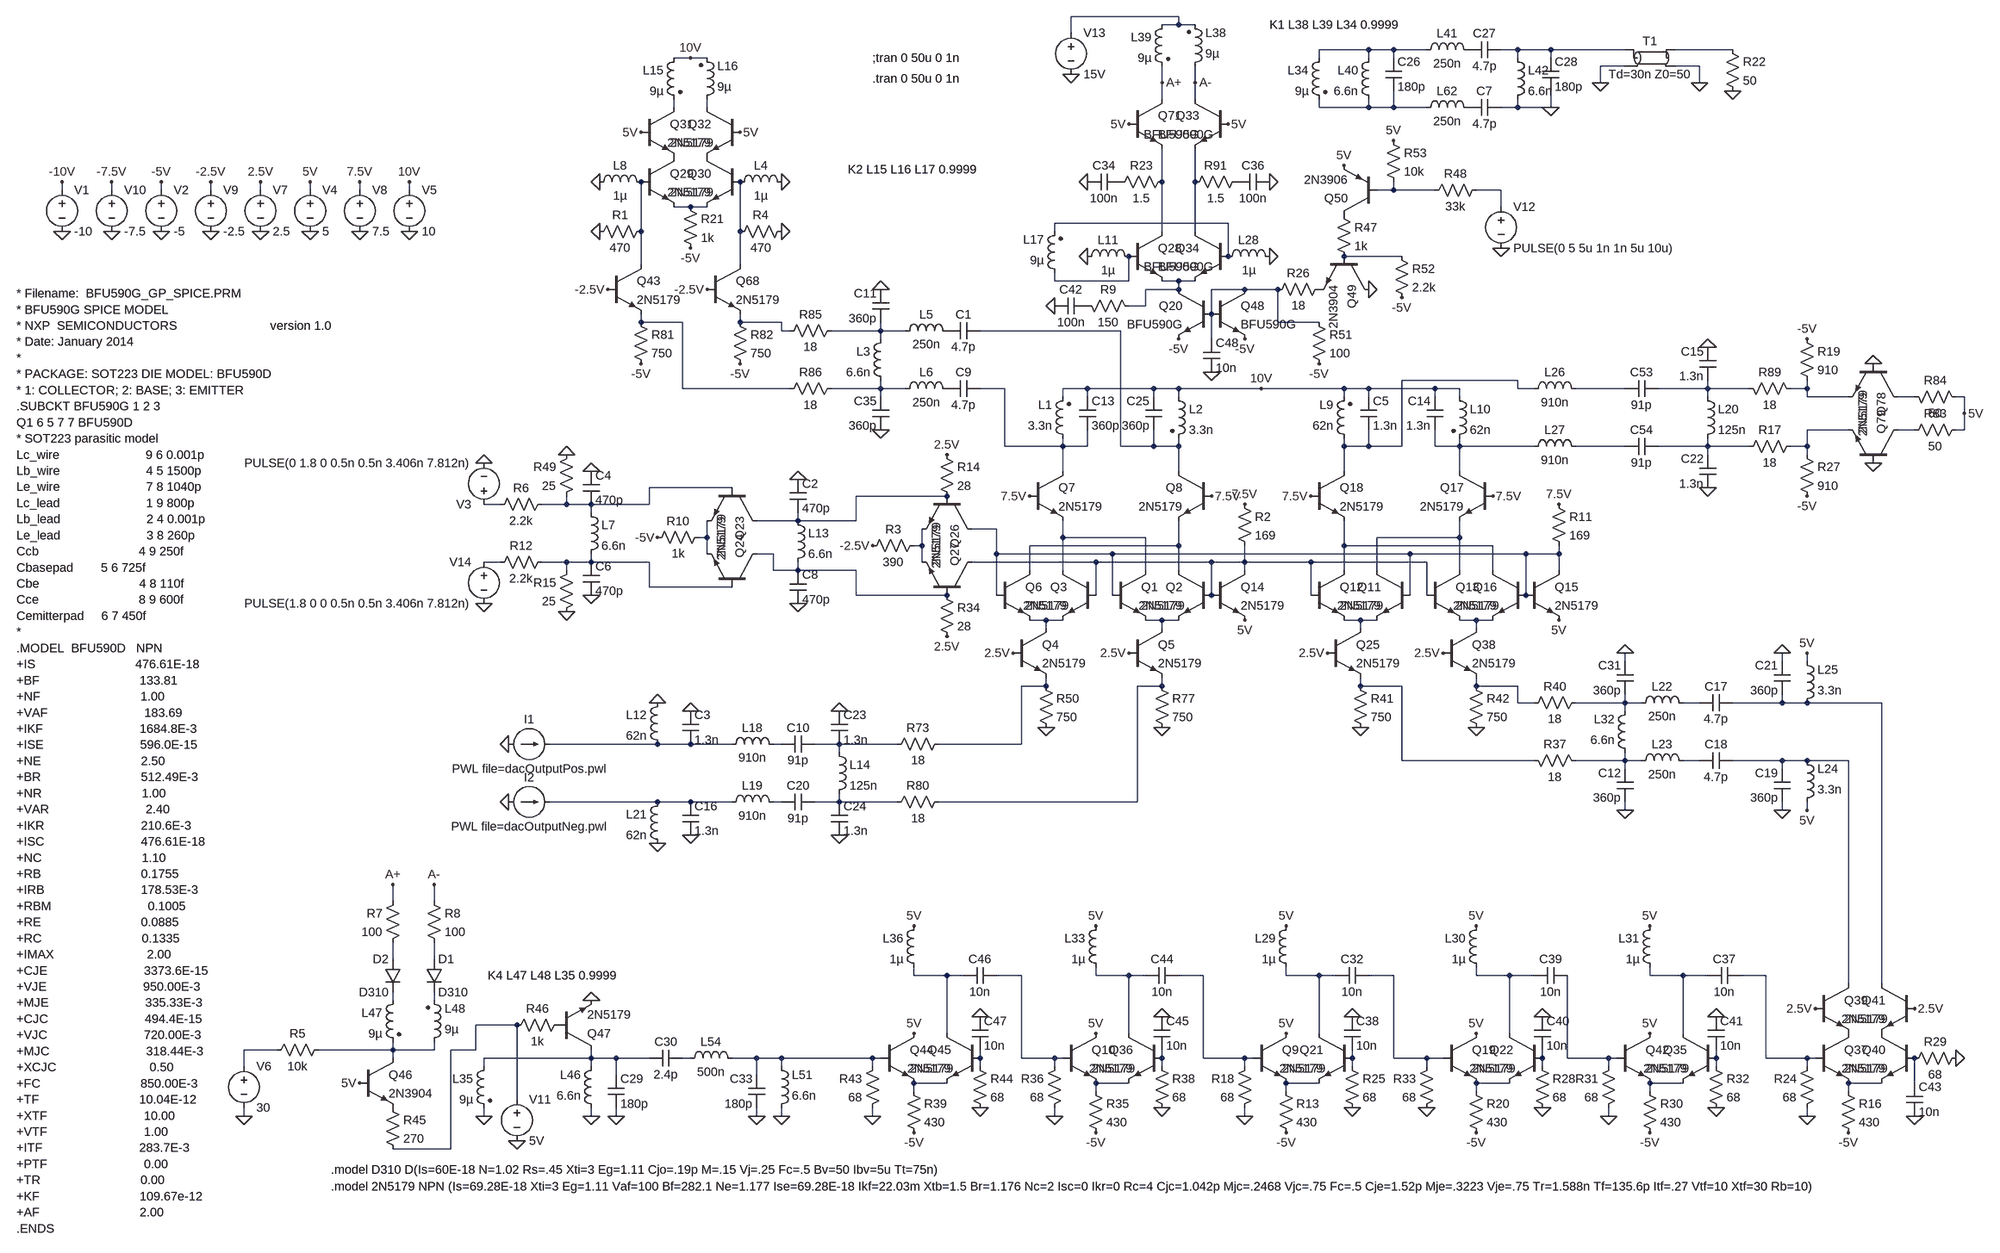
[diagram p0: schematic radio.asc]
radio.asc, the LTspice schematic file:
Version 4
SHEET 1 2964 2260
WIRE 352 -976 144 -976
WIRE 352 -960 352 -976
WIRE 352 -960 320 -960
WIRE 384 -960 352 -960
WIRE 144 -944 144 -976
WIRE 720 -912 624 -912
WIRE 768 -912 720 -912
WIRE 832 -912 768 -912
WIRE 1008 -912 976 -912
WIRE 1072 -912 1008 -912
WIRE 1216 -912 1072 -912
WIRE 1424 -912 1312 -912
WIRE -592 -896 -624 -896
WIRE -560 -896 -592 -896
WIRE 624 -896 624 -912
WIRE 720 -896 720 -912
WIRE 768 -896 768 -912
WIRE 1008 -896 1008 -912
WIRE 1072 -896 1072 -912
WIRE 1216 -880 1168 -880
WIRE 1360 -880 1312 -880
WIRE 320 -848 320 -880
WIRE 384 -848 384 -880
WIRE 1168 -848 1168 -880
WIRE 1360 -848 1360 -880
WIRE 320 -816 320 -848
WIRE 384 -816 384 -848
WIRE -624 -800 -624 -816
WIRE -560 -800 -560 -816
WIRE 624 -800 624 -816
WIRE 720 -800 720 -816
WIRE 720 -800 624 -800
WIRE 768 -800 768 -832
WIRE 768 -800 720 -800
WIRE 832 -800 768 -800
WIRE 1008 -800 1008 -816
WIRE 1008 -800 976 -800
WIRE 1072 -800 1072 -832
WIRE 1072 -800 1008 -800
WIRE 320 -656 320 -720
WIRE 384 -656 384 -720
WIRE -1808 -640 -1808 -656
WIRE -1712 -640 -1712 -656
WIRE -1616 -640 -1616 -656
WIRE -1520 -640 -1520 -656
WIRE -1424 -640 -1424 -656
WIRE -1328 -640 -1328 -656
WIRE -1232 -640 -1232 -656
WIRE -1136 -640 -1136 -656
WIRE 768 -640 768 -656
WIRE 768 -640 736 -640
WIRE 848 -640 768 -640
WIRE 976 -640 928 -640
WIRE -592 -608 -624 -608
WIRE -560 -608 -592 -608
WIRE 976 -608 976 -640
WIRE 448 -576 112 -576
WIRE -688 -560 -688 -656
WIRE -496 -560 -496 -656
WIRE 112 -560 112 -576
WIRE 320 -560 320 -656
WIRE 384 -560 384 -656
WIRE 448 -512 448 -576
WIRE 784 -512 672 -512
WIRE -688 -496 -688 -560
WIRE -496 -496 -496 -560
WIRE 112 -464 112 -480
WIRE 256 -464 256 -512
WIRE 256 -464 112 -464
WIRE 352 -464 320 -464
WIRE 384 -464 352 -464
WIRE 352 -448 352 -464
WIRE 352 -448 288 -448
WIRE 480 -448 416 -448
WIRE 544 -448 480 -448
WIRE 288 -416 288 -448
WIRE 288 -416 256 -416
WIRE 416 -400 416 -448
WIRE -688 -384 -688 -400
WIRE -608 -384 -688 -384
WIRE -496 -384 -496 -400
WIRE -416 -384 -496 -384
WIRE 544 -384 544 -448
WIRE 624 -384 544 -384
WIRE -416 -368 -416 -384
WIRE -400 -368 -416 -368
WIRE -224 -368 -224 -384
WIRE -224 -368 -320 -368
WIRE -176 -368 -224 -368
WIRE 240 -368 -32 -368
WIRE -224 -352 -224 -368
WIRE 416 -352 416 -400
WIRE 1008 -272 784 -272
WIRE -608 -256 -608 -384
WIRE -400 -256 -608 -256
WIRE -224 -256 -224 -272
WIRE -224 -256 -320 -256
WIRE -176 -256 -224 -256
WIRE 16 -256 -32 -256
WIRE 176 -256 128 -256
WIRE 304 -256 176 -256
WIRE 352 -256 304 -256
WIRE 512 -256 352 -256
WIRE 672 -256 512 -256
WIRE 720 -256 672 -256
WIRE 848 -256 720 -256
WIRE 896 -256 848 -256
WIRE 1008 -256 1008 -272
WIRE 1040 -256 1008 -256
WIRE 1216 -256 1120 -256
WIRE 1376 -256 1376 -272
WIRE 1376 -256 1280 -256
WIRE 1456 -256 1376 -256
WIRE 1568 -256 1568 -272
WIRE 1568 -256 1536 -256
WIRE -224 -240 -224 -256
WIRE 128 -240 128 -256
WIRE 176 -240 176 -256
WIRE 304 -240 304 -256
WIRE 352 -240 352 -256
WIRE 672 -240 672 -256
WIRE 720 -240 720 -256
WIRE 848 -240 848 -256
WIRE 896 -240 896 -256
WIRE 1376 -240 1376 -256
WIRE 1568 -240 1568 -256
WIRE 1648 -240 1568 -240
WIRE 1776 -240 1744 -240
WIRE 1872 -240 1856 -240
WIRE 1872 -208 1872 -240
WIRE 1648 -176 1568 -176
WIRE 1776 -176 1744 -176
WIRE 1872 -176 1872 -208
WIRE 1872 -176 1856 -176
WIRE 16 -144 16 -256
WIRE 128 -144 128 -160
WIRE 128 -144 16 -144
WIRE 176 -144 176 -176
WIRE 176 -144 128 -144
WIRE 240 -144 240 -368
WIRE 304 -144 304 -176
WIRE 304 -144 240 -144
WIRE 352 -144 352 -160
WIRE 352 -144 304 -144
WIRE 672 -144 672 -160
WIRE 720 -144 720 -176
WIRE 720 -144 672 -144
WIRE 784 -144 784 -272
WIRE 784 -144 720 -144
WIRE 848 -144 848 -176
WIRE 896 -144 896 -160
WIRE 896 -144 848 -144
WIRE 1040 -144 896 -144
WIRE 1216 -144 1120 -144
WIRE 1376 -144 1376 -160
WIRE 1376 -144 1280 -144
WIRE 1456 -144 1376 -144
WIRE 1568 -144 1568 -176
WIRE 1568 -144 1536 -144
WIRE 1376 -128 1376 -144
WIRE 1568 -128 1568 -144
WIRE 128 -96 128 -144
WIRE 352 -96 352 -144
WIRE 672 -96 672 -144
WIRE 896 -96 896 -144
WIRE -512 -64 -672 -64
WIRE -96 -48 -272 -48
WIRE -960 -32 -992 -32
WIRE -832 -32 -832 -48
WIRE -832 -32 -880 -32
WIRE -784 -32 -832 -32
WIRE -672 -32 -672 -64
WIRE -672 -32 -784 -32
WIRE -784 -16 -784 -32
WIRE -384 0 -384 -16
WIRE -384 0 -464 0
WIRE -272 0 -272 -48
WIRE -272 0 -384 0
WIRE 0 16 -48 16
WIRE -560 32 -560 0
WIRE -560 32 -576 32
WIRE 128 32 128 0
WIRE 288 32 128 32
WIRE 896 32 896 0
WIRE 896 32 736 32
WIRE -144 48 -144 16
WIRE -144 48 -160 48
WIRE 352 48 352 0
WIRE 352 48 64 48
WIRE 672 48 672 0
WIRE 960 48 672 48
WIRE -560 64 -560 32
WIRE -432 64 -464 64
WIRE 0 64 0 16
WIRE 224 64 0 64
WIRE 800 64 224 64
WIRE 1024 64 800 64
WIRE 1088 64 1088 48
WIRE 1088 64 1024 64
WIRE -960 80 -992 80
WIRE -832 80 -880 80
WIRE -784 80 -784 64
WIRE -784 80 -832 80
WIRE -672 80 -784 80
WIRE -144 80 -144 48
WIRE 192 80 -48 80
WIRE 416 80 192 80
WIRE 480 80 480 48
WIRE 480 80 416 80
WIRE 608 80 480 80
WIRE 832 80 608 80
WIRE -832 96 -832 80
WIRE -432 96 -432 64
WIRE -384 96 -384 80
WIRE -384 96 -432 96
WIRE -272 96 -384 96
WIRE 64 96 64 48
WIRE 128 96 128 32
WIRE 288 96 288 32
WIRE 352 96 352 48
WIRE 480 96 480 80
WIRE 672 96 672 48
WIRE 736 96 736 32
WIRE 896 96 896 32
WIRE 960 96 960 48
WIRE 1088 96 1088 64
WIRE -672 128 -672 80
WIRE -512 128 -672 128
WIRE -272 144 -272 96
WIRE -96 144 -272 144
WIRE 0 144 0 64
WIRE 192 144 192 80
WIRE 224 144 224 64
WIRE 416 144 416 80
WIRE 608 144 608 80
WIRE 800 144 800 64
WIRE 832 144 832 80
WIRE 1024 144 1024 64
WIRE 96 192 64 192
WIRE 128 192 96 192
WIRE 320 192 288 192
WIRE 352 192 320 192
WIRE 704 192 672 192
WIRE 736 192 704 192
WIRE 928 192 896 192
WIRE 960 192 928 192
WIRE 96 208 96 192
WIRE 320 208 320 192
WIRE 704 208 704 192
WIRE 928 208 928 192
WIRE 1216 272 1216 256
WIRE 1520 272 1520 256
WIRE 1568 272 1568 256
WIRE 96 320 96 304
WIRE 96 320 48 320
WIRE 320 320 320 304
WIRE 320 320 272 320
WIRE 704 320 704 304
WIRE 784 320 704 320
WIRE 928 320 928 304
WIRE 1008 320 928 320
WIRE 1008 352 1008 320
WIRE 1040 352 1008 352
WIRE 1216 352 1216 336
WIRE 1216 352 1120 352
WIRE 1248 352 1216 352
WIRE 1360 352 1328 352
WIRE 1520 352 1520 336
WIRE 1520 352 1424 352
WIRE 1568 352 1520 352
WIRE 1712 352 1568 352
WIRE 1216 368 1216 352
WIRE -656 432 -864 432
WIRE -592 432 -656 432
WIRE -512 432 -592 432
WIRE -416 432 -432 432
WIRE -304 432 -352 432
WIRE -192 432 -304 432
WIRE 48 432 48 320
WIRE 48 432 -112 432
WIRE -304 448 -304 432
WIRE 784 464 784 320
WIRE 1040 464 784 464
WIRE 1216 464 1216 448
WIRE 1216 464 1120 464
WIRE 1248 464 1216 464
WIRE 1360 464 1328 464
WIRE 1520 464 1424 464
WIRE 1568 464 1520 464
WIRE 1648 464 1568 464
WIRE 1216 480 1216 464
WIRE 1520 480 1520 464
WIRE -656 544 -864 544
WIRE -592 544 -656 544
WIRE -512 544 -592 544
WIRE -416 544 -432 544
WIRE -304 544 -304 528
WIRE -304 544 -352 544
WIRE -192 544 -304 544
WIRE 272 544 272 320
WIRE 272 544 -112 544
WIRE 1216 560 1216 544
WIRE 1520 560 1520 544
WIRE 1568 560 1568 544
WIRE -1168 736 -1168 704
WIRE -1088 736 -1088 704
WIRE -1168 848 -1168 816
WIRE -1088 848 -1088 816
WIRE -160 880 -160 864
WIRE -96 880 -160 880
WIRE -64 880 -96 880
WIRE 48 880 0 880
WIRE 192 880 192 864
WIRE 256 880 192 880
WIRE 288 880 256 880
WIRE 400 880 352 880
WIRE 560 880 560 864
WIRE 624 880 560 880
WIRE 656 880 624 880
WIRE 768 880 720 880
WIRE 928 880 928 864
WIRE 992 880 928 880
WIRE 1040 880 992 880
WIRE 1264 880 1264 864
WIRE 1328 880 1264 880
WIRE 1376 880 1328 880
WIRE 1488 880 1440 880
WIRE 1648 896 1648 464
WIRE 1712 896 1712 352
WIRE -1168 928 -1168 912
WIRE -1088 928 -1088 912
WIRE -928 976 -1008 976
WIRE -96 992 -96 880
WIRE 256 992 256 880
WIRE 624 992 624 880
WIRE 992 992 992 880
WIRE 1328 992 1328 880
WIRE -1392 1024 -1456 1024
WIRE -1168 1024 -1168 1008
WIRE -1168 1024 -1312 1024
WIRE -1088 1024 -1088 1008
WIRE -1088 1024 -1168 1024
WIRE -1008 1024 -1008 976
WIRE -1008 1024 -1056 1024
WIRE -1168 1040 -1168 1024
WIRE -784 1040 -784 1024
WIRE -784 1040 -992 1040
WIRE -736 1040 -784 1040
WIRE -672 1040 -736 1040
WIRE -592 1040 -608 1040
WIRE -464 1040 -512 1040
WIRE -416 1040 -464 1040
WIRE -240 1040 -416 1040
WIRE -224 1040 -240 1040
WIRE -32 1040 -32 1024
WIRE 48 1040 48 880
WIRE 112 1040 48 1040
WIRE 128 1040 112 1040
WIRE 320 1040 320 1024
WIRE 400 1040 400 880
WIRE 480 1040 400 1040
WIRE 496 1040 480 1040
WIRE 688 1040 688 1024
WIRE 768 1040 768 880
WIRE 832 1040 768 1040
WIRE 864 1040 832 1040
WIRE 1056 1040 1056 1024
WIRE 1104 1040 1104 880
WIRE 1184 1040 1104 1040
WIRE 1200 1040 1184 1040
WIRE 1392 1040 1392 1024
WIRE 1488 1040 1488 880
WIRE 1568 1040 1488 1040
WIRE 1584 1040 1568 1040
WIRE -1456 1056 -1456 1024
WIRE -992 1056 -992 1040
WIRE -784 1056 -784 1040
WIRE -416 1056 -416 1040
WIRE -240 1056 -240 1040
WIRE -32 1056 -32 1040
WIRE 112 1056 112 1040
WIRE 320 1056 320 1040
WIRE 480 1056 480 1040
WIRE 688 1056 688 1040
WIRE 832 1056 832 1040
WIRE 1056 1056 1056 1040
WIRE 1184 1056 1184 1040
WIRE 1392 1056 1392 1040
WIRE 1568 1056 1568 1040
WIRE -736 1072 -736 1040
WIRE -464 1072 -464 1040
WIRE -96 1088 -160 1088
WIRE 256 1088 192 1088
WIRE 624 1088 560 1088
WIRE 992 1088 928 1088
WIRE 1328 1088 1264 1088
WIRE 1712 1088 1648 1088
WIRE 1776 1088 1776 1040
WIRE -160 1104 -160 1088
WIRE 192 1104 192 1088
WIRE 560 1104 560 1088
WIRE 928 1104 928 1088
WIRE 1264 1104 1264 1088
WIRE 1648 1104 1648 1088
WIRE -928 1120 -928 976
WIRE -1456 1152 -1456 1136
WIRE -992 1152 -992 1136
WIRE -784 1152 -784 1136
WIRE -736 1152 -736 1136
WIRE -464 1152 -464 1136
WIRE -416 1152 -416 1136
WIRE -240 1152 -240 1136
WIRE 112 1152 112 1136
WIRE 480 1152 480 1136
WIRE 1184 1152 1184 1136
WIRE 1568 1152 1568 1136
WIRE -1056 1216 -1056 1024
WIRE -1056 1216 -1168 1216
FLAG -1808 -560 0
FLAG -1328 -560 0
FLAG -1136 -560 0
FLAG -1328 -656 5V
FLAG 1168 -848 0
FLAG 1360 -848 0
FLAG 1424 -832 0
FLAG -592 -896 10V
FLAG 448 -768 5V
FLAG 1696 -304 0
FLAG 1696 -112 0
FLAG 1872 -208 5V
FLAG -656 32 -5V
FLAG -1168 704 A+
FLAG -1088 704 A-
FLAG -1456 1152 0
FLAG -1520 -560 0
FLAG -1424 -560 0
FLAG -1232 -560 0
FLAG -1520 -656 -2.5V
FLAG -1424 -656 2.5V
FLAG -1232 -656 7.5V
FLAG -1712 -560 0
FLAG -1712 -656 -7.5V
FLAG 144 -864 0
FLAG 1072 -800 0
FLAG 1568 -352 -5V
FLAG 1568 -48 -5V
FLAG -1136 -656 10V
FLAG -768 -656 0
FLAG -592 608 0
FLAG -592 368 0
FLAG -304 608 0
FLAG -304 368 0
FLAG -1808 -656 -10V
FLAG -1616 -560 0
FLAG -1616 -656 -5V
FLAG 64 -48 7.5V
FLAG 416 -48 7.5V
FLAG 608 -48 7.5V
FLAG 960 -48 7.5V
FLAG -384 -80 0
FLAG -384 160 0
FLAG 512 -256 10V
FLAG -224 -448 0
FLAG -224 -176 0
FLAG -992 -112 0
FLAG -992 160 0
FLAG -784 -96 0
FLAG -784 144 0
FLAG 1376 -64 0
FLAG 1376 -336 0
FLAG -656 352 0
FLAG -656 624 0
FLAG -944 432 0
FLAG -944 544 0
FLAG 256 -768 5V
FLAG -688 -752 5V
FLAG 176 -512 0
FLAG 528 -512 0
FLAG 1520 256 0
FLAG 1520 560 0
FLAG 1568 256 5V
FLAG 1568 560 5V
FLAG 1216 256 0
FLAG 1216 560 0
FLAG 480 192 5V
FLAG 1088 192 5V
FLAG 480 -32 7.5V
FLAG 1088 -32 7.5V
FLAG -832 -128 0
FLAG -832 176 0
FLAG 32 256 2.5V
FLAG 256 256 2.5V
FLAG 96 400 0
FLAG 320 400 0
FLAG -240 48 -2.5V
FLAG -96 -128 2.5V
FLAG -96 224 2.5V
FLAG 640 256 2.5V
FLAG 864 256 2.5V
FLAG 704 400 0
FLAG 928 400 0
FLAG -416 -656 0
FLAG -752 -448 -2.5V
FLAG -688 -304 -5V
FLAG -496 -304 -5V
FLAG -560 -448 -2.5V
FLAG 176 -656 0
FLAG 528 -656 0
FLAG -496 -752 5V
FLAG 320 -848 A+
FLAG 384 -848 A-
FLAG -768 -560 0
FLAG -416 -560 0
FLAG -416 1152 0
FLAG 560 1184 -5V
FLAG 560 784 5V
FLAG -784 1152 0
FLAG -464 1152 0
FLAG -736 1152 0
FLAG -992 1152 0
FLAG 480 1152 0
FLAG 928 1184 -5V
FLAG 928 784 5V
FLAG 1648 1184 -5V
FLAG 1584 944 2.5V
FLAG 1568 1152 0
FLAG 1776 944 2.5V
FLAG 1856 1040 0
FLAG 1264 1184 -5V
FLAG 1264 784 5V
FLAG 1184 1152 0
FLAG 112 -416 0
FLAG 688 1136 0
FLAG 1056 1136 0
FLAG 1392 1136 0
FLAG 688 960 0
FLAG 1056 960 0
FLAG 1392 960 0
FLAG 1776 1152 0
FLAG 832 1136 0
FLAG 560 992 5V
FLAG 928 992 5V
FLAG 1264 992 5V
FLAG 192 1184 -5V
FLAG 192 784 5V
FLAG 112 1152 0
FLAG 320 1136 0
FLAG 320 960 0
FLAG 192 992 5V
FLAG -160 1184 -5V
FLAG -160 784 5V
FLAG -240 1152 0
FLAG -32 1136 0
FLAG -32 960 0
FLAG -160 992 5V
FLAG -1232 1088 5V
FLAG -784 928 0
FLAG -928 1200 0
FLAG -592 -528 -5V
FLAG 352 -352 -5V
FLAG 480 -352 -5V
FLAG 720 -448 0
FLAG 672 -688 5V
FLAG 976 -528 0
FLAG 624 -304 -5V
FLAG 784 -432 -5V
FLAG 416 -288 0
FLAG 768 -736 5V
SYMBOL npn 224 96 R0
SYMATTR InstName Q1
SYMATTR Value 2N5179
SYMBOL npn 416 96 M0
SYMATTR InstName Q2
SYMATTR Value 2N5179
SYMBOL npn 192 96 M0
SYMATTR InstName Q3
SYMATTR Value 2N5179
SYMBOL npn 0 96 R0
SYMATTR InstName Q6
SYMATTR Value 2N5179
SYMBOL npn 64 -96 R0
SYMATTR InstName Q7
SYMATTR Value 2N5179
SYMBOL npn 416 -96 M0
SYMATTR InstName Q8
SYMATTR Value 2N5179
SYMBOL ind2 144 -144 R180
WINDOW 0 36 80 Left 2
WINDOW 3 36 40 Left 2
SYMATTR InstName L1
SYMATTR Value 3.3n
SYMATTR Type ind
SYMBOL ind2 336 -256 R0
SYMATTR InstName L2
SYMATTR Value 3.3n
SYMATTR Type ind
SYMBOL voltage -1808 -656 R0
WINDOW 123 0 0 Left 2
WINDOW 39 0 0 Left 2
SYMATTR InstName V1
SYMATTR Value -10
SYMBOL npn 800 96 M0
SYMATTR InstName Q11
SYMATTR Value 2N5179
SYMBOL npn 608 96 R0
SYMATTR InstName Q12
SYMATTR Value 2N5179
SYMBOL npn 832 96 R0
SYMATTR InstName Q13
SYMATTR Value 2N5179
SYMBOL npn 1024 96 M0
SYMATTR InstName Q16
SYMATTR Value 2N5179
SYMBOL npn 960 -96 M0
SYMATTR InstName Q17
SYMATTR Value 2N5179
SYMBOL npn 608 -96 R0
SYMATTR InstName Q18
SYMATTR Value 2N5179
SYMBOL voltage -1328 -656 R0
WINDOW 123 0 0 Left 2
WINDOW 39 0 0 Left 2
SYMATTR InstName V4
SYMATTR Value 5
SYMBOL voltage -1136 -656 R0
WINDOW 123 0 0 Left 2
WINDOW 39 0 0 Left 2
SYMATTR InstName V5
SYMATTR Value 10
SYMBOL npn -464 -64 R90
SYMATTR InstName Q23
SYMATTR Value 2N5179
SYMBOL npn -464 128 M270
SYMATTR InstName Q24
SYMATTR Value 2N5179
SYMBOL res -560 16 R90
WINDOW 0 0 56 VBottom 2
WINDOW 3 32 56 VTop 2
SYMATTR InstName R10
SYMATTR Value 1k
SYMBOL ind -528 448 R270
WINDOW 0 32 56 VTop 2
WINDOW 3 5 56 VBottom 2
SYMATTR InstName L18
SYMATTR Value 910n
SYMBOL ind -528 560 R270
WINDOW 0 32 56 VTop 2
WINDOW 3 5 56 VBottom 2
SYMATTR InstName L19
SYMATTR Value 910n
SYMBOL ind 1344 368 M270
WINDOW 0 32 56 VTop 2
WINDOW 3 5 56 VBottom 2
SYMATTR InstName L22
SYMATTR Value 250n
SYMBOL ind 1344 480 M270
WINDOW 0 32 56 VTop 2
WINDOW 3 5 56 VBottom 2
SYMATTR InstName L23
SYMATTR Value 250n
SYMBOL cap 1360 336 M90
WINDOW 0 0 32 VBottom 2
WINDOW 3 32 32 VTop 2
SYMATTR InstName C17
SYMATTR Value 4.7p
SYMBOL cap 1360 448 M90
WINDOW 0 0 32 VBottom 2
WINDOW 3 32 32 VTop 2
SYMATTR InstName C18
SYMATTR Value 4.7p
SYMBOL cap 1536 480 M0
SYMATTR InstName C19
SYMATTR Value 360p
SYMBOL ind 1552 560 M180
WINDOW 0 36 80 Left 2
WINDOW 3 36 40 Left 2
SYMATTR InstName L24
SYMATTR Value 3.3n
SYMBOL ind 1552 368 M180
WINDOW 0 36 80 Left 2
WINDOW 3 36 40 Left 2
SYMATTR InstName L25
SYMATTR Value 3.3n
SYMBOL npn -688 -704 R0
SYMATTR InstName Q29
SYMATTR Value 2N5179
SYMBOL npn -496 -704 M0
SYMATTR InstName Q30
SYMATTR Value 2N5179
SYMBOL ind2 368 -864 M180
WINDOW 0 36 80 Left 2
WINDOW 3 36 40 Left 2
SYMATTR InstName L38
SYMATTR Value 9µ
SYMATTR Type ind
SYMATTR SpiceLine Rser=80m
SYMBOL ind2 336 -976 M0
SYMATTR InstName L39
SYMATTR Value 9µ
SYMATTR Type ind
SYMATTR SpiceLine Rser=80m
SYMBOL ind 736 -912 M0
SYMATTR InstName L40
SYMATTR Value 6.6n
SYMBOL cap 752 -896 R0
SYMATTR InstName C26
SYMATTR Value 180p
SYMBOL ind 816 -896 R270
WINDOW 0 32 56 VTop 2
WINDOW 3 5 56 VBottom 2
SYMATTR InstName L41
SYMATTR Value 250n
SYMBOL cap 976 -928 R90
WINDOW 0 0 32 VBottom 2
WINDOW 3 32 32 VTop 2
SYMATTR InstName C27
SYMATTR Value 4.7p
SYMBOL ind 992 -912 R0
SYMATTR InstName L42
SYMATTR Value 6.6n
SYMBOL cap 1056 -896 R0
SYMATTR InstName C28
SYMATTR Value 180p
SYMBOL tline 1264 -896 R0
SYMATTR InstName T1
SYMATTR Value Td=30n Z0=50
SYMBOL ind2 -1152 912 M0
SYMATTR InstName L47
SYMATTR Value 9µ
SYMATTR Type ind
SYMATTR SpiceLine Rser=80m
SYMBOL ind2 -1104 1024 M180
WINDOW 0 36 80 Left 2
WINDOW 3 36 40 Left 2
SYMATTR InstName L48
SYMATTR Value 9µ
SYMATTR Type ind
SYMATTR SpiceLine Rser=80m
SYMBOL cap -752 1072 R0
SYMATTR InstName C29
SYMATTR Value 180p
SYMBOL ind -608 1056 R270
WINDOW 0 32 56 VTop 2
WINDOW 3 5 56 VBottom 2
SYMATTR InstName L54
SYMATTR Value 500n
SYMBOL cap -608 1024 R90
WINDOW 0 0 32 VBottom 2
WINDOW 3 32 32 VTop 2
SYMATTR InstName C30
SYMATTR Value 2.4p
SYMBOL cap -448 1072 M0
SYMATTR InstName C33
SYMATTR Value 180p
SYMBOL npn -688 -800 R0
SYMATTR InstName Q31
SYMATTR Value 2N5179
SYMBOL npn -496 -800 M0
SYMATTR InstName Q32
SYMATTR Value 2N5179
SYMBOL npn 1744 -304 R90
SYMATTR InstName Q78
SYMATTR Value 2N5179
SYMBOL npn 1744 -112 M270
SYMATTR InstName Q79
SYMATTR Value 2N5179
SYMBOL res 1872 -192 R90
WINDOW 0 0 56 VBottom 2
WINDOW 3 32 56 VTop 2
SYMATTR InstName R83
SYMATTR Value 50
SYMBOL res 1872 -224 M270
WINDOW 0 32 56 VTop 2
WINDOW 3 0 56 VBottom 2
SYMATTR InstName R84
SYMATTR Value 50
SYMBOL res 1552 -160 R90
WINDOW 0 0 56 VBottom 2
WINDOW 3 32 56 VTop 2
SYMATTR InstName R17
SYMATTR Value 18
SYMBOL res 1552 -240 M270
WINDOW 0 32 56 VTop 2
WINDOW 3 0 56 VBottom 2
SYMATTR InstName R89
SYMATTR Value 18
SYMBOL ind2 -608 -912 M0
SYMATTR InstName L15
SYMATTR Value 9µ
SYMATTR Type ind
SYMATTR SpiceLine Rser=80m
SYMBOL ind2 -576 -800 M180
WINDOW 0 36 80 Left 2
WINDOW 3 36 40 Left 2
SYMATTR InstName L16
SYMATTR Value 9µ
SYMATTR Type ind
SYMATTR SpiceLine Rser=80m
SYMBOL ind2 128 -464 R180
WINDOW 0 36 80 Left 2
WINDOW 3 36 40 Left 2
SYMATTR InstName L17
SYMATTR Value 9µ
SYMATTR Type ind
SYMBOL ind2 640 -912 M0
SYMATTR InstName L34
SYMATTR Value 9µ
SYMATTR Type ind
SYMATTR SpiceLine Rser=80m
SYMBOL diode -1104 848 R0
SYMATTR InstName D1
SYMATTR Value D310
SYMBOL diode -1152 848 M0
SYMATTR InstName D2
SYMATTR Value D310
SYMBOL res -1152 720 M0
SYMATTR InstName R7
SYMATTR Value 100
SYMBOL res -1104 720 R0
SYMATTR InstName R8
SYMATTR Value 100
SYMBOL voltage -1456 1040 R0
WINDOW 123 0 0 Left 2
WINDOW 39 0 0 Left 2
SYMATTR InstName V6
SYMATTR Value 30
SYMBOL ind2 -976 1040 M0
SYMATTR InstName L35
SYMATTR Value 9µ
SYMATTR Type ind
SYMBOL res -1296 1008 R90
WINDOW 0 0 56 VBottom 2
WINDOW 3 32 56 VTop 2
SYMATTR InstName R5
SYMATTR Value 10k
SYMBOL ind -768 1152 R180
WINDOW 0 36 80 Left 2
WINDOW 3 36 40 Left 2
SYMATTR InstName L46
SYMATTR Value 6.6n
SYMBOL voltage -1424 -656 R0
WINDOW 123 0 0 Left 2
WINDOW 39 0 0 Left 2
SYMATTR InstName V7
SYMATTR Value 2.5
SYMBOL voltage -1232 -656 R0
WINDOW 123 0 0 Left 2
WINDOW 39 0 0 Left 2
SYMATTR InstName V8
SYMATTR Value 7.5
SYMBOL voltage -1520 -656 R0
WINDOW 123 0 0 Left 2
WINDOW 39 0 0 Left 2
SYMATTR InstName V9
SYMATTR Value -2.5
SYMBOL voltage -1712 -656 R0
WINDOW 123 0 0 Left 2
WINDOW 39 0 0 Left 2
SYMATTR InstName V10
SYMATTR Value -7.5
SYMBOL ind -432 1152 M180
WINDOW 0 36 80 Left 2
WINDOW 3 36 40 Left 2
SYMATTR InstName L51
SYMATTR Value 6.6n
SYMBOL voltage 144 -960 R0
WINDOW 123 0 0 Left 2
WINDOW 39 0 0 Left 2
SYMATTR InstName V13
SYMATTR Value 15V
SYMBOL ind 816 -784 R270
WINDOW 0 32 56 VTop 2
WINDOW 3 5 56 VBottom 2
SYMATTR InstName L62
SYMATTR Value 250n
SYMBOL cap 976 -816 R90
WINDOW 0 0 32 VBottom 2
WINDOW 3 32 32 VTop 2
SYMATTR InstName C7
SYMATTR Value 4.7p
SYMBOL ind2 688 -144 R180
WINDOW 0 36 80 Left 2
WINDOW 3 36 40 Left 2
SYMATTR InstName L9
SYMATTR Value 62n
SYMATTR Type ind
SYMBOL ind2 880 -256 R0
SYMATTR InstName L10
SYMATTR Value 62n
SYMATTR Type ind
SYMBOL res 1552 -368 R0
SYMATTR InstName R19
SYMATTR Value 910
SYMBOL res 1552 -144 R0
SYMATTR InstName R27
SYMATTR Value 910
SYMBOL ind -80 -352 M270
WINDOW 0 32 56 VTop 2
WINDOW 3 5 56 VBottom 2
SYMATTR InstName L5
SYMATTR Value 250n
SYMBOL ind -80 -240 M270
WINDOW 0 32 56 VTop 2
WINDOW 3 5 56 VBottom 2
SYMATTR InstName L6
SYMATTR Value 250n
SYMBOL cap -96 -384 M90
WINDOW 0 0 32 VBottom 2
WINDOW 3 32 32 VTop 2
SYMATTR InstName C1
SYMATTR Value 4.7p
SYMBOL cap -96 -272 M90
WINDOW 0 0 32 VBottom 2
WINDOW 3 32 32 VTop 2
SYMATTR InstName C9
SYMATTR Value 4.7p
SYMBOL cap -608 368 R0
SYMATTR InstName C3
SYMATTR Value 1.3n
SYMBOL cap -608 544 R0
SYMATTR InstName C16
SYMATTR Value 1.3n
SYMBOL cap -320 368 R0
SYMATTR InstName C23
SYMATTR Value 1.3n
SYMBOL cap -320 544 R0
SYMATTR InstName C24
SYMATTR Value 1.3n
SYMBOL voltage -1616 -656 R0
WINDOW 123 0 0 Left 2
WINDOW 39 0 0 Left 2
SYMATTR InstName V2
SYMATTR Value -5
SYMBOL cap -400 -80 R0
SYMATTR InstName C2
SYMATTR Value 470p
SYMBOL cap -400 96 R0
SYMATTR InstName C8
SYMATTR Value 470p
SYMBOL cap 160 -240 R0
SYMATTR InstName C13
SYMATTR Value 360p
SYMBOL cap 320 -240 M0
SYMATTR InstName C25
SYMATTR Value 360p
SYMBOL ind -640 336 M0
SYMATTR InstName L12
SYMATTR Value 62n
SYMBOL ind -640 528 M0
SYMATTR InstName L21
SYMATTR Value 62n
SYMBOL cap -208 -384 R180
WINDOW 0 24 56 Left 2
WINDOW 3 24 8 Left 2
SYMATTR InstName C11
SYMATTR Value 360p
SYMBOL cap -208 -176 R180
WINDOW 0 24 56 Left 2
WINDOW 3 24 8 Left 2
SYMATTR InstName C35
SYMATTR Value 360p
SYMBOL voltage -992 -16 R180
WINDOW 123 0 0 Left 2
WINDOW 39 0 0 Left 2
SYMATTR InstName V3
SYMATTR Value PULSE(0 1.8 0 0.5n 0.5n 3.406n 7.812n)
SYMBOL voltage -992 64 M0
WINDOW 123 0 0 Left 2
WINDOW 39 0 0 Left 2
SYMATTR InstName V14
SYMATTR Value PULSE(1.8 0 0 0.5n 0.5n 3.406n 7.812n)
SYMBOL res -864 -48 R90
WINDOW 0 0 56 VBottom 2
WINDOW 3 32 56 VTop 2
SYMATTR InstName R6
SYMATTR Value 2.2k
SYMBOL res -864 64 R90
WINDOW 0 0 56 VBottom 2
WINDOW 3 32 56 VTop 2
SYMATTR InstName R12
SYMATTR Value 2.2k
SYMBOL cap -800 -96 R0
SYMATTR InstName C4
SYMATTR Value 470p
SYMBOL cap -800 80 R0
SYMATTR InstName C6
SYMATTR Value 470p
SYMBOL ind -800 -32 R0
SYMATTR InstName L7
SYMATTR Value 6.6n
SYMBOL cap -352 416 R90
WINDOW 0 0 32 VBottom 2
WINDOW 3 32 32 VTop 2
SYMATTR InstName C10
SYMATTR Value 91p
SYMBOL cap -352 528 R90
WINDOW 0 0 32 VBottom 2
WINDOW 3 32 32 VTop 2
SYMATTR InstName C20
SYMATTR Value 91p
SYMBOL cap 704 -240 R0
SYMATTR InstName C5
SYMATTR Value 1.3n
SYMBOL cap 864 -240 M0
SYMATTR InstName C14
SYMATTR Value 1.3n
SYMBOL ind 1360 -256 R0
SYMATTR InstName L20
SYMATTR Value 125n
SYMBOL cap 1392 -336 M0
SYMATTR InstName C15
SYMATTR Value 1.3n
SYMBOL cap 1392 -128 M0
SYMATTR InstName C22
SYMATTR Value 1.3n
SYMBOL ind 1024 -240 R270
WINDOW 0 32 56 VTop 2
WINDOW 3 5 56 VBottom 2
SYMATTR InstName L26
SYMATTR Value 910n
SYMBOL ind 1024 -128 R270
WINDOW 0 32 56 VTop 2
WINDOW 3 5 56 VBottom 2
SYMATTR InstName L27
SYMATTR Value 910n
SYMBOL cap 1280 -272 R90
WINDOW 0 0 32 VBottom 2
WINDOW 3 32 32 VTop 2
SYMATTR InstName C53
SYMATTR Value 91p
SYMBOL cap 1280 -160 R90
WINDOW 0 0 32 VBottom 2
WINDOW 3 32 32 VTop 2
SYMATTR InstName C54
SYMATTR Value 91p
SYMBOL current -944 432 R270
WINDOW 0 32 40 VTop 2
WINDOW 3 -32 40 VBottom 2
WINDOW 123 0 0 Left 2
WINDOW 39 0 0 Left 2
SYMATTR InstName I1
SYMATTR Value PWL file=dacOutputPos.pwl
SYMBOL current -944 544 R270
WINDOW 0 32 40 VTop 2
WINDOW 3 -32 40 VBottom 2
WINDOW 123 0 0 Left 2
WINDOW 39 0 0 Left 2
SYMATTR InstName I2
SYMATTR Value PWL file=dacOutputNeg.pwl
SYMBOL res -608 -624 R0
SYMATTR InstName R21
SYMATTR Value 1k
SYMBOL cap 1536 272 M0
SYMATTR InstName C21
SYMATTR Value 360p
SYMBOL cap 1232 480 M0
SYMATTR InstName C12
SYMATTR Value 360p
SYMBOL cap 1232 272 M0
SYMATTR InstName C31
SYMATTR Value 360p
SYMBOL ind 1232 464 R180
WINDOW 0 36 80 Left 2
WINDOW 3 36 40 Left 2
SYMATTR InstName L32
SYMATTR Value 6.6n
SYMBOL res 1024 448 M90
WINDOW 0 0 56 VBottom 2
WINDOW 3 32 56 VTop 2
SYMATTR InstName R37
SYMATTR Value 18
SYMBOL res 1024 368 R270
WINDOW 0 32 56 VTop 2
WINDOW 3 0 56 VBottom 2
SYMATTR InstName R40
SYMATTR Value 18
SYMBOL npn 416 96 R0
SYMATTR InstName Q14
SYMATTR Value 2N5179
SYMBOL npn 1024 96 R0
SYMATTR InstName Q15
SYMATTR Value 2N5179
SYMBOL res 464 -48 R0
SYMATTR InstName R2
SYMATTR Value 169
SYMBOL res 1072 -48 R0
SYMATTR InstName R11
SYMATTR Value 169
SYMBOL ind -400 -16 R0
SYMATTR InstName L13
SYMATTR Value 6.6n
SYMBOL npn -48 -48 R90
SYMATTR InstName Q26
SYMATTR Value 2N5179
SYMBOL npn -48 144 M270
SYMATTR InstName Q27
SYMATTR Value 2N5179
SYMBOL res -816 80 M0
SYMATTR InstName R15
SYMATTR Value 25
SYMBOL res -816 -144 M0
SYMATTR InstName R49
SYMATTR Value 25
SYMBOL ind -320 432 R0
SYMATTR InstName L14
SYMATTR Value 125n
SYMBOL npn 32 208 R0
SYMATTR InstName Q4
SYMATTR Value 2N5179
SYMBOL npn 256 208 R0
SYMATTR InstName Q5
SYMATTR Value 2N5179
SYMBOL res 80 304 R0
SYMATTR InstName R50
SYMATTR Value 750
SYMBOL res 304 304 R0
SYMATTR InstName R77
SYMATTR Value 750
SYMBOL res -96 416 R90
WINDOW 0 0 56 VBottom 2
WINDOW 3 32 56 VTop 2
SYMATTR InstName R73
SYMATTR Value 18
SYMBOL res -96 528 R90
WINDOW 0 0 56 VBottom 2
WINDOW 3 32 56 VTop 2
SYMATTR InstName R80
SYMATTR Value 18
SYMBOL res -144 32 R90
WINDOW 0 0 56 VBottom 2
WINDOW 3 32 56 VTop 2
SYMATTR InstName R3
SYMATTR Value 390
SYMBOL res -112 -144 R0
SYMATTR InstName R14
SYMATTR Value 28
SYMBOL res -112 128 R0
SYMATTR InstName R34
SYMATTR Value 28
SYMBOL npn 640 208 R0
SYMATTR InstName Q25
SYMATTR Value 2N5179
SYMBOL npn 864 208 R0
SYMATTR InstName Q38
SYMATTR Value 2N5179
SYMBOL res 688 304 R0
SYMATTR InstName R41
SYMATTR Value 750
SYMBOL res 912 304 R0
SYMATTR InstName R42
SYMATTR Value 750
SYMBOL ind -208 -368 M0
SYMATTR InstName L3
SYMATTR Value 6.6n
SYMBOL npn -752 -496 R0
SYMATTR InstName Q43
SYMATTR Value 2N5179
SYMBOL npn -560 -496 R0
SYMATTR InstName Q68
SYMATTR Value 2N5179
SYMBOL res -704 -400 R0
SYMATTR InstName R81
SYMATTR Value 750
SYMBOL res -512 -400 R0
SYMATTR InstName R82
SYMATTR Value 750
SYMBOL res -304 -384 R90
WINDOW 0 0 56 VBottom 2
WINDOW 3 32 56 VTop 2
SYMATTR InstName R85
SYMATTR Value 18
SYMBOL res -304 -272 R90
WINDOW 0 0 56 VBottom 2
WINDOW 3 32 56 VTop 2
SYMATTR InstName R86
SYMATTR Value 18
SYMBOL npn 256 -816 R0
SYMATTR InstName Q71
SYMATTR Value BFU590G
SYMATTR Prefix XN
SYMBOL res 336 -672 R90
WINDOW 0 0 56 VBottom 2
WINDOW 3 32 56 VTop 2
SYMATTR InstName R23
SYMATTR Value 1.5
SYMBOL res 480 -672 R90
WINDOW 0 0 56 VBottom 2
WINDOW 3 32 56 VTop 2
SYMATTR InstName R91
SYMATTR Value 1.5
SYMBOL cap 240 -672 R90
WINDOW 0 0 32 VBottom 2
WINDOW 3 32 32 VTop 2
SYMATTR InstName C34
SYMATTR Value 100n
SYMBOL cap 528 -672 R90
WINDOW 0 0 32 VBottom 2
WINDOW 3 32 32 VTop 2
SYMATTR InstName C36
SYMATTR Value 100n
SYMBOL npn 256 -560 R0
SYMATTR InstName Q28
SYMATTR Value BFU590G
SYMATTR Prefix XN
SYMBOL npn 448 -816 M0
SYMATTR InstName Q33
SYMATTR Value BFU590G
SYMATTR Prefix XN
SYMBOL npn 448 -560 M0
SYMATTR InstName Q34
SYMATTR Value BFU590G
SYMATTR Prefix XN
SYMBOL ind -512 -640 R270
WINDOW 0 32 56 VTop 2
WINDOW 3 5 56 VBottom 2
SYMATTR InstName L4
SYMATTR Value 1µ
SYMBOL ind -784 -640 R270
WINDOW 0 32 56 VTop 2
WINDOW 3 5 56 VBottom 2
SYMATTR InstName L8
SYMATTR Value 1µ
SYMBOL ind 160 -496 R270
WINDOW 0 32 56 VTop 2
WINDOW 3 5 56 VBottom 2
SYMATTR InstName L11
SYMATTR Value 1µ
SYMBOL ind 432 -496 R270
WINDOW 0 32 56 VTop 2
WINDOW 3 5 56 VBottom 2
SYMATTR InstName L28
SYMATTR Value 1µ
SYMBOL res -672 -576 R90
WINDOW 0 0 56 VBottom 2
WINDOW 3 32 56 VTop 2
SYMATTR InstName R1
SYMATTR Value 470
SYMBOL res -400 -576 R90
WINDOW 0 0 56 VBottom 2
WINDOW 3 32 56 VTop 2
SYMATTR InstName R4
SYMATTR Value 470
SYMBOL npn 496 992 R0
SYMATTR InstName Q9
SYMATTR Value 2N5179
SYMBOL res 544 1088 R0
SYMATTR InstName R13
SYMATTR Value 430
SYMBOL ind 576 768 M0
SYMATTR InstName L29
SYMATTR Value 1µ
SYMBOL cap 720 864 R90
WINDOW 0 0 32 VBottom 2
WINDOW 3 32 32 VTop 2
SYMATTR InstName C32
SYMATTR Value 10n
SYMBOL res 496 1040 M0
SYMATTR InstName R18
SYMATTR Value 68
SYMBOL npn 864 992 R0
SYMATTR InstName Q19
SYMATTR Value 2N5179
SYMBOL res 912 1088 R0
SYMATTR InstName R20
SYMATTR Value 430
SYMBOL ind 944 768 M0
SYMATTR InstName L30
SYMATTR Value 1µ
SYMBOL cap 1104 864 R90
WINDOW 0 0 32 VBottom 2
WINDOW 3 32 32 VTop 2
SYMATTR InstName C39
SYMATTR Value 10n
SYMBOL npn 1584 992 R0
SYMATTR InstName Q37
SYMATTR Value 2N5179
SYMBOL res 1632 1088 R0
SYMATTR InstName R16
SYMATTR Value 430
SYMBOL npn 1584 896 R0
SYMATTR InstName Q39
SYMATTR Value 2N5179
SYMBOL res 1584 1040 M0
SYMATTR InstName R24
SYMATTR Value 68
SYMBOL npn 1776 992 M0
SYMATTR InstName Q40
SYMATTR Value 2N5179
SYMBOL npn 1776 896 M0
SYMATTR InstName Q41
SYMATTR Value 2N5179
SYMBOL res 1872 1024 R90
WINDOW 0 0 56 VBottom 2
WINDOW 3 32 56 VTop 2
SYMATTR InstName R29
SYMATTR Value 68
SYMBOL res 640 -464 R90
WINDOW 0 0 56 VBottom 2
WINDOW 3 32 56 VTop 2
SYMATTR InstName R26
SYMATTR Value 18
SYMBOL npn 1200 992 R0
SYMATTR InstName Q42
SYMATTR Value 2N5179
SYMBOL res 1248 1088 R0
SYMATTR InstName R30
SYMATTR Value 430
SYMBOL ind 1280 768 M0
SYMATTR InstName L31
SYMATTR Value 1µ
SYMBOL cap 1440 864 R90
WINDOW 0 0 32 VBottom 2
WINDOW 3 32 32 VTop 2
SYMATTR InstName C37
SYMATTR Value 10n
SYMBOL res 1200 1040 M0
SYMATTR InstName R31
SYMATTR Value 68
SYMBOL cap 112 -432 M90
WINDOW 0 0 32 VBottom 2
WINDOW 3 32 32 VTop 2
SYMATTR InstName C42
SYMATTR Value 100n
SYMBOL res 160 -432 M90
WINDOW 0 0 56 VBottom 2
WINDOW 3 32 56 VTop 2
SYMATTR InstName R9
SYMATTR Value 150
SYMBOL npn 416 -448 M0
SYMATTR InstName Q20
SYMATTR Value BFU590G
SYMATTR Prefix XN
SYMBOL res 1408 -928 R0
SYMATTR InstName R22
SYMATTR Value 50
SYMBOL npn 688 992 M0
SYMATTR InstName Q21
SYMATTR Value 2N5179
SYMBOL npn 1056 992 M0
SYMATTR InstName Q22
SYMATTR Value 2N5179
SYMBOL npn 1392 992 M0
SYMATTR InstName Q35
SYMATTR Value 2N5179
SYMBOL res 672 1040 R0
SYMATTR InstName R25
SYMATTR Value 68
SYMBOL res 1040 1040 R0
SYMATTR InstName R28
SYMATTR Value 68
SYMBOL res 1376 1040 R0
SYMATTR InstName R32
SYMATTR Value 68
SYMBOL cap 672 960 R0
SYMATTR InstName C38
SYMATTR Value 10n
SYMBOL cap 1040 960 R0
SYMATTR InstName C40
SYMATTR Value 10n
SYMBOL cap 1376 960 R0
SYMATTR InstName C41
SYMATTR Value 10n
SYMBOL cap 1760 1088 R0
SYMATTR InstName C43
SYMATTR Value 10n
SYMBOL res 848 1040 M0
SYMATTR InstName R33
SYMATTR Value 68
SYMBOL npn 128 992 R0
SYMATTR InstName Q10
SYMATTR Value 2N5179
SYMBOL res 176 1088 R0
SYMATTR InstName R35
SYMATTR Value 430
SYMBOL ind 208 768 M0
SYMATTR InstName L33
SYMATTR Value 1µ
SYMBOL cap 352 864 R90
WINDOW 0 0 32 VBottom 2
WINDOW 3 32 32 VTop 2
SYMATTR InstName C44
SYMATTR Value 10n
SYMBOL res 128 1040 M0
SYMATTR InstName R36
SYMATTR Value 68
SYMBOL npn 320 992 M0
SYMATTR InstName Q36
SYMATTR Value 2N5179
SYMBOL res 304 1040 R0
SYMATTR InstName R38
SYMATTR Value 68
SYMBOL cap 304 960 R0
SYMATTR InstName C45
SYMATTR Value 10n
SYMBOL npn -224 992 R0
SYMATTR InstName Q44
SYMATTR Value 2N5179
SYMBOL res -176 1088 R0
SYMATTR InstName R39
SYMATTR Value 430
SYMBOL ind -144 768 M0
SYMATTR InstName L36
SYMATTR Value 1µ
SYMBOL cap 0 864 R90
WINDOW 0 0 32 VBottom 2
WINDOW 3 32 32 VTop 2
SYMATTR InstName C46
SYMATTR Value 10n
SYMBOL res -224 1040 M0
SYMATTR InstName R43
SYMATTR Value 68
SYMBOL npn -32 992 M0
SYMATTR InstName Q45
SYMATTR Value 2N5179
SYMBOL res -48 1040 R0
SYMATTR InstName R44
SYMATTR Value 68
SYMBOL cap -48 960 R0
SYMATTR InstName C47
SYMATTR Value 10n
SYMBOL npn -1232 1040 R0
SYMATTR InstName Q46
SYMATTR Value 2N3904
SYMBOL res -1184 1120 R0
SYMATTR InstName R45
SYMATTR Value 270
SYMBOL npn -848 1024 M180
SYMATTR InstName Q47
SYMATTR Value 2N5179
SYMBOL voltage -928 1104 R0
WINDOW 123 0 0 Left 2
WINDOW 39 0 0 Left 2
SYMATTR InstName V11
SYMATTR Value 5V
SYMBOL res -832 960 R90
WINDOW 0 0 56 VBottom 2
WINDOW 3 32 56 VTop 2
SYMATTR InstName R46
SYMATTR Value 1k
SYMBOL npn 416 -448 R0
SYMATTR InstName Q48
SYMATTR Value BFU590G
SYMATTR Prefix XN
SYMBOL npn 720 -512 R90
SYMATTR InstName Q49
SYMATTR Value 2N3904
SYMBOL res 656 -608 R0
SYMATTR InstName R47
SYMATTR Value 1k
SYMBOL pnp 736 -592 R180
SYMATTR InstName Q50
SYMATTR Value 2N3906
SYMBOL res 944 -656 R90
WINDOW 0 0 56 VBottom 2
WINDOW 3 32 56 VTop 2
SYMATTR InstName R48
SYMATTR Value 33k
SYMBOL voltage 976 -624 R0
WINDOW 123 0 0 Left 2
WINDOW 39 0 0 Left 2
SYMATTR InstName V12
SYMATTR Value PULSE(0 5 5u 1n 1n 5u 10u)
SYMBOL res 608 -400 R0
SYMATTR InstName R51
SYMATTR Value 100
SYMBOL res 768 -528 R0
SYMATTR InstName R52
SYMATTR Value 2.2k
SYMBOL cap 400 -352 R0
SYMATTR InstName C48
SYMATTR Value 10n
SYMBOL res 752 -752 R0
SYMATTR InstName R53
SYMATTR Value 10k
TEXT -1288 1288 Left 2 !.model 2N5179 NPN (Is=69.28E-18 Xti=3 Eg=1.11 Vaf=100 Bf=282.1 Ne=1.177 Ise=69.28E-18 Ikf=22.03m Xtb=1.5 Br=1.176 Nc=2 Isc=0 Ikr=0 Rc=4 Cjc=1.042p Mjc=.2468 Vjc=.75 Fc=.5 Cje=1.52p Mje=.3223 Vje=.75 Tr=1.588n Tf=135.6p Itf=.27 Vtf=10 Xtf=30 Rb=10)
TEXT -240 -896 Left 2 !;tran 0 50u 0 1n
TEXT -240 -856 Left 2 !.tran 0 50u 0 1n
TEXT 528 -960 Left 2 !K1 L38 L39 L34 0.9999
TEXT -288 -680 Left 2 !K2 L15 L16 L17 0.9999
TEXT -984 880 Left 2 !K4 L47 L48 L35 0.9999
TEXT -1288 1256 Left 2 !.model D310 D(Is=60E-18 N=1.02 Rs=.45 Xti=3 Eg=1.11 Cjo=.19p M=.15 Vj=.25 Fc=.5 Bv=50 Ibv=5u Tt=75n)
TEXT -1896 -440 Left 2 !* Filename:  BFU590G_GP_SPICE.PRM\n* BFU590G SPICE MODEL\n* NXP  SEMICONDUCTORS                           version 1.0\n* Date: January 2014\n*\n* PACKAGE: SOT223 DIE MODEL: BFU590D\n* 1: COLLECTOR; 2: BASE; 3: EMITTER\n.SUBCKT BFU590G 1 2 3\nQ1 6 5 7 7 BFU590D\n* SOT223 parasitic model\nLc_wire                         9 6 0.001p\nLb_wire                         4 5 1500p \nLe_wire                         7 8 1040p\nLc_lead                         1 9 800p\nLb_lead                         2 4 0.001p\nLe_lead                         3 8 260p\nCcb                             4 9 250f\nCbasepad        5 6 725f\nCbe                             4 8 110f\nCce                             8 9 600f\nCemitterpad     6 7 450f\n*\n.MODEL  BFU590D   NPN\n+IS                             476.61E-18 \n+BF                             133.81\n+NF                             1.00\n+VAF                            183.69\n+IKF                            1684.8E-3\n+ISE                            596.0E-15\n+NE                             2.50\n+BR                             512.49E-3\n+NR                             1.00\n+VAR                            2.40\n+IKR                            210.6E-3\n+ISC                            476.61E-18\n+NC                             1.10\n+RB                             0.1755\n+IRB                            178.53E-3\n+RBM                            0.1005\n+RE                             0.0885\n+RC                             0.1335\n+IMAX                           2.00\n+CJE                            3373.6E-15\n+VJE                            950.00E-3\n+MJE                            335.33E-3\n+CJC                            494.4E-15\n+VJC                            720.00E-3       \n+MJC                            318.44E-3       \n+XCJC                           0.50\n+FC                             850.00E-3       \n+TF                             10.04E-12\n+XTF                            10.00           \n+VTF                            1.00            \n+ITF                            283.7E-3        \n+PTF                            0.00\n+TR                             0.00\n+KF                             109.67e-12\n+AF                             2.00\n.ENDS

The netlist it stands for:
* radio.asc
Q1 N041 N039 N051 0 2N5179
Q2 N044 N049 N051 0 2N5179
Q3 N041 N049 N050 0 2N5179
Q6 N044 N039 N050 0 2N5179
Q7 N026 7.5V N041 0 2N5179
Q8 N023 7.5V N044 0 2N5179
L1 N026 10V 3.3n
L2 10V N023 3.3n
V1 -10V 0 -10
Q11 N042 N039 N052 0 2N5179
Q12 N045 N049 N052 0 2N5179
Q13 N042 N049 N053 0 2N5179
Q16 N045 N039 N053 0 2N5179
Q17 N033 7.5V N042 0 2N5179
Q18 N024 7.5V N045 0 2N5179
V4 5V 0 5
V5 10V 0 10
Q23 N037 N036 N040 0 2N5179
Q24 N046 N048 N040 0 2N5179
R10 N040 -5V 1k
L18 N061 N062 910n
L19 N067 N068 910n
L22 N059 N058 250n
L23 N065 N064 250n
C17 N059 N060 4.7p
C18 N065 N066 4.7p
C19 N066 0 360p
L24 5V N066 3.3n
L25 N060 5V 3.3n
Q29 P001 N014 N012 0 2N5179
Q30 P002 N015 N012 0 2N5179
L38 A- N001 9µ Rser=80m
L39 N001 A+ 9µ Rser=80m
L40 N002 N007 6.6n
C26 N002 N007 180p
L41 N002 P003 250n
C27 N003 P003 4.7p
L42 N003 0 6.6n
C28 N003 0 180p
T1 N003 0 N004 0 Td=30n Z0=50
L47 N081 N085 9µ Rser=80m
L48 N085 N082 9µ Rser=80m
C29 N086 0 180p
L54 N087 N088 500n
C30 N087 N086 2.4p
C33 N088 0 180p
Q31 N005 5V P001 0 2N5179
Q32 N006 5V P002 0 2N5179
Q78 N030 0 N029 0 2N5179
Q79 N032 0 N031 0 2N5179
R83 5V N032 50
R84 5V N030 50
R17 N031 N035 18
R89 N029 N028 18
L15 10V N005 9µ Rser=80m
L16 N006 10V 9µ Rser=80m
L17 N017 N013 9µ
L34 N002 N007 9µ Rser=80m
D1 N071 N082 D310
D2 N070 N081 D310
R7 A+ N070 100
R8 A- N071 100
V6 N084 0 30
L35 N086 0 9µ
R5 N085 N084 10k
L46 0 N086 6.6n
V7 2.5V 0 2.5
V8 7.5V 0 7.5
V9 -2.5V 0 -2.5
V10 -7.5V 0 -7.5
L51 0 N088 6.6n
V13 N001 0 15V
L62 N007 P004 250n
C7 0 P004 4.7p
L9 N024 10V 62n
L10 10V N033 62n
R19 -5V N029 910
R27 N031 -5V 910
L5 P005 N022 250n
L6 P006 N025 250n
C1 P005 N023 4.7p
C9 P006 N026 4.7p
C3 0 N061 1.3n
C16 N067 0 1.3n
C23 0 N063 1.3n
C24 N069 0 1.3n
V2 -5V 0 -5
C2 0 N037 470p
C8 N046 0 470p
C13 10V N026 360p
C25 10V N023 360p
L12 0 N061 62n
L21 N067 0 62n
C11 N022 0 360p
C35 0 N025 360p
V3 N038 0 PULSE(0 1.8 0 0.5n 0.5n 3.406n 7.812n)
V14 N047 0 PULSE(1.8 0 0 0.5n 0.5n 3.406n 7.812n)
R6 N036 N038 2.2k
R12 N048 N047 2.2k
C4 0 N036 470p
C6 N048 0 470p
L7 N036 N048 6.6n
C10 N063 N062 91p
C20 N069 N068 91p
C5 10V N024 1.3n
C14 10V N033 1.3n
L20 N028 N035 125n
C15 0 N028 1.3n
C22 N035 0 1.3n
L26 N024 N027 910n
L27 N033 N034 910n
C53 N028 N027 91p
C54 N035 N034 91p
I1 0 N061 PWL file=dacOutputPos.pwl
I2 0 N067 PWL file=dacOutputNeg.pwl
R21 N012 -5V 1k
C21 0 N060 360p
C12 N064 0 360p
C31 0 N058 360p
L32 N064 N058 6.6n
R37 N056 N064 18
R40 N057 N058 18
Q14 N049 N049 5V 0 2N5179
Q15 N039 N039 5V 0 2N5179
R2 7.5V N049 169
R11 7.5V N039 169
L13 N037 N046 6.6n
Q26 N039 N037 N043 0 2N5179
Q27 N049 N046 N043 0 2N5179
R15 N048 0 25
R49 0 N036 25
L14 N063 N069 125n
Q4 N050 2.5V N054 0 2N5179
Q5 N051 2.5V N055 0 2N5179
R50 N054 0 750
R77 N055 0 750
R73 N054 N063 18
R80 N055 N069 18
R3 N043 -2.5V 390
R14 2.5V N037 28
R34 N046 2.5V 28
Q25 N052 2.5V N056 0 2N5179
Q38 N053 2.5V N057 0 2N5179
R41 N056 0 750
R42 N057 0 750
L3 N022 N025 6.6n
Q43 N014 -2.5V N020 0 2N5179
Q68 N015 -2.5V N021 0 2N5179
R81 N020 -5V 750
R82 N021 -5V 750
R85 N022 N021 18
R86 N025 N020 18
XQ71 A+ 5V N008 BFU590G  ; pins C B E
R23 N008 P007 1.5
R91 P008 N009 1.5
C34 P007 0 100n
C36 0 P008 100n
XQ28 N008 N017 N018 BFU590G  ; pins C B E
XQ33 A- 5V N009 BFU590G  ; pins C B E
XQ34 N009 N013 N018 BFU590G  ; pins C B E
L4 N015 0 1µ
L8 0 N014 1µ
L11 0 N017 1µ
L28 N013 0 1µ
R1 N014 0 470
R4 0 N015 470
Q9 5V N075 N097 0 2N5179
R13 N097 -5V 430
L29 5V N076 1µ
C32 N077 N076 10n
R18 N075 0 68
Q19 5V N077 N098 0 2N5179
R20 N098 -5V 430
L30 5V N078 1µ
C39 N093 N078 10n
Q37 P009 N080 N100 0 2N5179
R16 N100 -5V 430
Q39 N066 2.5V P009 0 2N5179
R24 N080 0 68
Q40 P010 N101 N100 0 2N5179
Q41 N060 2.5V P010 0 2N5179
R29 0 N101 68
R26 P011 N019 18
Q42 5V N093 N099 0 2N5179
R30 N099 -5V 430
L31 5V N079 1µ
C37 N080 N079 10n
R31 N093 0 68
C42 0 P012 100n
R9 P012 N018 150
XQ20 N018 N019 -5V BFU590G  ; pins C B E
R22 N004 0 50
Q21 N076 N091 N097 0 2N5179
Q22 N078 N092 N098 0 2N5179
Q35 N079 N094 N099 0 2N5179
R25 N091 0 68
R28 N092 0 68
R32 N094 0 68
C38 0 N091 10n
C40 0 N092 10n
C41 0 N094 10n
C43 N101 0 10n
R33 N077 0 68
Q10 5V N073 N096 0 2N5179
R35 N096 -5V 430
L33 5V N074 1µ
C44 N075 N074 10n
R36 N073 0 68
Q36 N074 N090 N096 0 2N5179
R38 N090 0 68
C45 0 N090 10n
Q44 5V N088 N095 0 2N5179
R39 N095 -5V 430
L36 5V N072 1µ
C46 N073 N072 10n
R43 N088 0 68
Q45 N072 N089 N095 0 2N5179
R44 N089 0 68
C47 0 N089 10n
Q46 N085 5V P013 0 2N3904
R45 P013 N083 270
Q47 N086 P014 0 0 2N5179
V11 N083 0 5V
R46 P014 N083 1k
XQ48 N019 N019 -5V BFU590G  ; pins C B E
Q49 0 N016 P011 0 2N3904
R47 P015 N016 1k
Q50 P015 N010 5V 0 2N3906
R48 N011 N010 33k
V12 N011 0 PULSE(0 5 5u 1n 1n 5u 10u)
R51 N019 -5V 100
R52 N016 -5V 2.2k
C48 N019 0 10n
R53 5V N010 10k
.model D D
.lib standard.dio
.model NPN NPN
.model PNP PNP
.lib standard.bjt
.model 2N5179 NPN (Is=69.28E-18 Xti=3 Eg=1.11 Vaf=100 Bf=282.1 Ne=1.177 Ise=69.28E-18 Ikf=22.03m Xtb=1.5 Br=1.176 Nc=2 Isc=0 Ikr=0 Rc=4 Cjc=1.042p Mjc=.2468 Vjc=.75 Fc=.5 Cje=1.52p Mje=.3223 Vje=.75 Tr=1.588n Tf=135.6p Itf=.27 Vtf=10 Xtf=30 Rb=10)
;tran 0 50u 0 1n
.tran 0 50u 0 1n
K1 L38 L39 L34 0.9999
K2 L15 L16 L17 0.9999
K4 L47 L48 L35 0.9999
.model D310 D(Is=60E-18 N=1.02 Rs=.45 Xti=3 Eg=1.11 Cjo=.19p M=.15 Vj=.25 Fc=.5 Bv=50 Ibv=5u Tt=75n)
* Filename:  BFU590G_GP_SPICE.PRM
* BFU590G SPICE MODEL
* NXP  SEMICONDUCTORS                           version 1.0
* Date: January 2014
*
* PACKAGE: SOT223 DIE MODEL: BFU590D
* 1: COLLECTOR; 2: BASE; 3: EMITTER
.SUBCKT BFU590G 1 2 3
Q1 6 5 7 7 BFU590D
* SOT223 parasitic model
Lc_wire                         9 6 0.001p
Lb_wire                         4 5 1500p
Le_wire                         7 8 1040p
Lc_lead                         1 9 800p
Lb_lead                         2 4 0.001p
Le_lead                         3 8 260p
Ccb                             4 9 250f
Cbasepad        5 6 725f
Cbe                             4 8 110f
Cce                             8 9 600f
Cemitterpad     6 7 450f
*
.MODEL  BFU590D   NPN
+IS                             476.61E-18
+BF                             133.81
+NF                             1.00
+VAF                            183.69
+IKF                            1684.8E-3
+ISE                            596.0E-15
+NE                             2.50
+BR                             512.49E-3
+NR                             1.00
+VAR                            2.40
+IKR                            210.6E-3
+ISC                            476.61E-18
+NC                             1.10
+RB                             0.1755
+IRB                            178.53E-3
+RBM                            0.1005
+RE                             0.0885
+RC                             0.1335
+IMAX                           2.00
+CJE                            3373.6E-15
+VJE                            950.00E-3
+MJE                            335.33E-3
+CJC                            494.4E-15
+VJC                            720.00E-3
+MJC                            318.44E-3
+XCJC                           0.50
+FC                             850.00E-3
+TF                             10.04E-12
+XTF                            10.00
+VTF                            1.00
+ITF                            283.7E-3
+PTF                            0.00
+TR                             0.00
+KF                             109.67e-12
+AF                             2.00
.ENDS
.backanno
.end